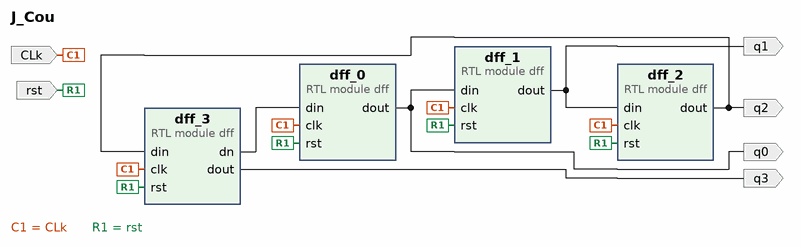
[diagram p0: block diagram of the top level]
# Vivado block design J_Cou, xc7a35tcpg236-1, Vivado 2025.1
create_bd_design J_Cou

create_bd_port -dir I -type rst rst
set_property -dict {CONFIG.POLARITY ACTIVE_HIGH} [get_bd_ports rst]
create_bd_port -dir I -type clk CLk
set_property -dict {CONFIG.FREQ_HZ 100000000} [get_bd_ports CLk]
create_bd_port -dir O q0
create_bd_port -dir O q1
create_bd_port -dir O q2
create_bd_port -dir O q3

create_bd_cell -type module -reference dff dff_0
create_bd_cell -type module -reference dff dff_1
create_bd_cell -type module -reference dff dff_2
create_bd_cell -type module -reference dff dff_3

# ---- connections ----

connect_bd_net [get_bd_ports CLk] [get_bd_pins dff_0/clk] [get_bd_pins dff_1/clk] [get_bd_pins dff_2/clk] [get_bd_pins dff_3/clk]
connect_bd_net [get_bd_pins dff_0/dout] [get_bd_pins dff_1/din] [get_bd_ports q0]
connect_bd_net [get_bd_pins dff_1/dout] [get_bd_pins dff_2/din] [get_bd_ports q1]
connect_bd_net [get_bd_pins dff_2/dout] [get_bd_pins dff_3/din] [get_bd_ports q2]
connect_bd_net [get_bd_pins dff_3/dn] [get_bd_pins dff_0/din]
connect_bd_net [get_bd_pins dff_3/dout] [get_bd_ports q3]
connect_bd_net [get_bd_ports rst] [get_bd_pins dff_0/rst] [get_bd_pins dff_1/rst] [get_bd_pins dff_2/rst] [get_bd_pins dff_3/rst]

validate_bd_design
save_bd_design
